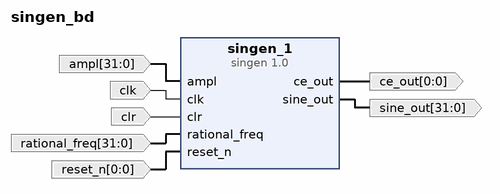
[diagram p0: block diagram of the top level]
# Vivado block design singen_bd, xc7z030sbg485-1, Vivado 2020.2
create_bd_design singen_bd

create_bd_port -dir I -from 31 -to 0 -type data ampl
create_bd_port -dir O -from 0 -to 0 -type data ce_out
create_bd_port -dir I -type clk clk
create_bd_port -dir I -type data clr
create_bd_port -dir I -from 31 -to 0 -type data rational_freq
create_bd_port -dir I -from 0 -to 0 -type data reset_n
create_bd_port -dir O -from 31 -to 0 -type data sine_out

create_bd_cell -type ip -vlnv MaxIV:Panda_SysGen:singen:1.0 singen_1

# ---- connections ----

connect_bd_net [get_bd_ports ampl] [get_bd_pins singen_1/ampl]
connect_bd_net [get_bd_pins singen_1/ce_out] [get_bd_ports ce_out]
connect_bd_net [get_bd_ports clk] [get_bd_pins singen_1/clk]
connect_bd_net [get_bd_ports clr] [get_bd_pins singen_1/clr]
connect_bd_net [get_bd_ports rational_freq] [get_bd_pins singen_1/rational_freq]
connect_bd_net [get_bd_ports reset_n] [get_bd_pins singen_1/reset_n]
connect_bd_net [get_bd_pins singen_1/sine_out] [get_bd_ports sine_out]

validate_bd_design
save_bd_design
